# Altium schematic sheet AnalogTransform.SchDoc
size A4; Organization: Technokrat; Address1: 3 Minna Close; Address2: Belrose; Address3: NSW 2085; Address4: Australia; SheetNumber: 4; SheetTotal: 10
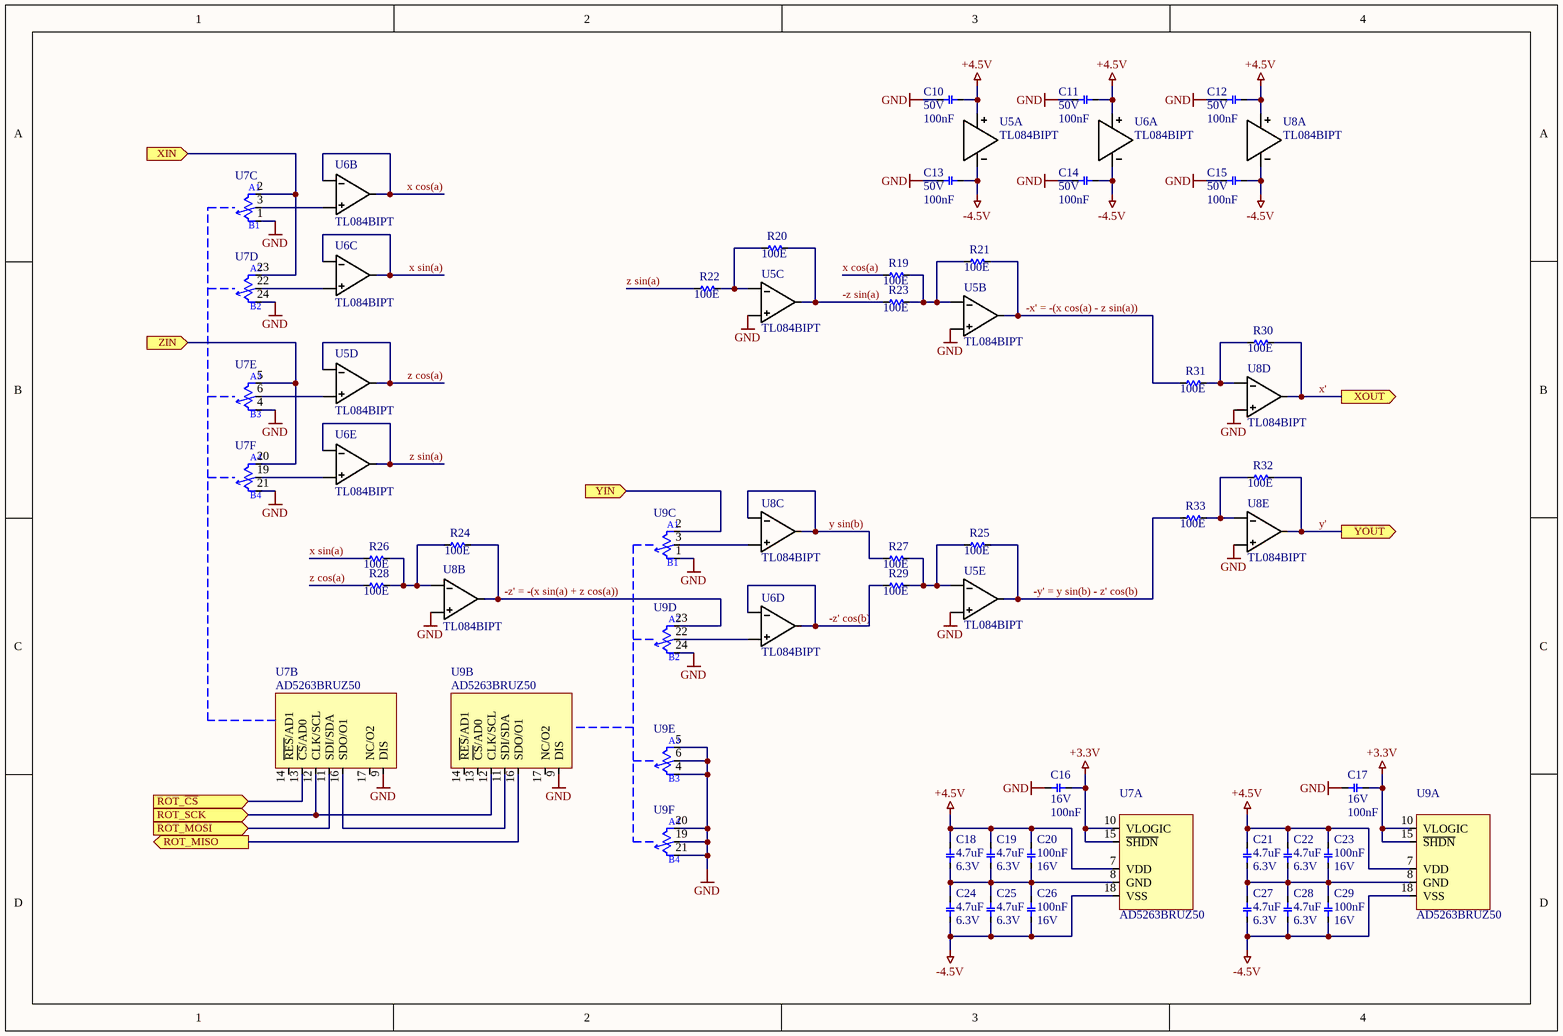
[diagram p0: AnalogTransform.SchDoc]

## Parts
C10  value 100nF  Value2: 50V  [CX7R0402C]  (hidden comment: 04025C104JAT2A)
C11  value 100nF  Value2: 50V  [CX7R0402C]  (hidden comment: 04025C104JAT2A)
C12  value 100nF  Value2: 50V  [CX7R0402C]  (hidden comment: 04025C104JAT2A)
C13  value 100nF  Value2: 50V  [CX7R0402C]  (hidden comment: 04025C104JAT2A)
C14  value 100nF  Value2: 50V  [CX7R0402C]  (hidden comment: 04025C104JAT2A)
C15  value 100nF  Value2: 50V  [CX7R0402C]  (hidden comment: 04025C104JAT2A)
C16  value 100nF  Value2: 16V  [CX7R0402C]  (hidden comment: 0402YC104JAT2A)
C17  value 100nF  Value2: 16V  [CX7R0402C]  (hidden comment: 0402YC104JAT2A)
C18  value 4.7uF  Value2: 6.3V  [CX7R0603K]  (hidden comment: 06036C475JAT2A)
C19  value 4.7uF  Value2: 6.3V  [CX7R0603K]  (hidden comment: 06036C475JAT2A)
C20  value 100nF  Value2: 16V  [CX7R0402C]  (hidden comment: 0402YC104JAT2A)
C21  value 4.7uF  Value2: 6.3V  [CX7R0603K]  (hidden comment: 06036C475JAT2A)
C22  value 4.7uF  Value2: 6.3V  [CX7R0603K]  (hidden comment: 06036C475JAT2A)
C23  value 100nF  Value2: 16V  [CX7R0402C]  (hidden comment: 0402YC104JAT2A)
C24  value 4.7uF  Value2: 6.3V  [CX7R0603K]  (hidden comment: 06036C475JAT2A)
C25  value 4.7uF  Value2: 6.3V  [CX7R0603K]  (hidden comment: 06036C475JAT2A)
C26  value 100nF  Value2: 16V  [CX7R0402C]  (hidden comment: 0402YC104JAT2A)
C27  value 4.7uF  Value2: 6.3V  [CX7R0603K]  (hidden comment: 06036C475JAT2A)
C28  value 4.7uF  Value2: 6.3V  [CX7R0603K]  (hidden comment: 06036C475JAT2A)
C29  value 100nF  Value2: 16V  [CX7R0402C]  (hidden comment: 0402YC104JAT2A)
R19  value 100E  [RC0402]  (hidden comment: 0402FR-07100RL)
R20  value 100E  [RC0402]  (hidden comment: 0402FR-07100RL)
R21  value 100E  [RC0402]  (hidden comment: 0402FR-07100RL)
R22  value 100E  [RC0402]  (hidden comment: 0402FR-07100RL)
R23  value 100E  [RC0402]  (hidden comment: 0402FR-07100RL)
R24  value 100E  [RC0402]  (hidden comment: 0402FR-07100RL)
R25  value 100E  [RC0402]  (hidden comment: 0402FR-07100RL)
R26  value 100E  [RC0402]  (hidden comment: 0402FR-07100RL)
R27  value 100E  [RC0402]  (hidden comment: 0402FR-07100RL)
R28  value 100E  [RC0402]  (hidden comment: 0402FR-07100RL)
R29  value 100E  [RC0402]  (hidden comment: 0402FR-07100RL)
R30  value 100E  [RC0402]  (hidden comment: 0402FR-07100RL)
R31  value 100E  [RC0402]  (hidden comment: 0402FR-07100RL)
R32  value 100E  [RC0402]  (hidden comment: 0402FR-07100RL)
R33  value 100E  [RC0402]  (hidden comment: 0402FR-07100RL)
U5  TL084BIPT  [TSSOP14_0.65_C]  (parts A,B,C,D,E of 5)
U6  TL084BIPT  [TSSOP14_0.65_C]  (parts A,B,C,D,E of 5)
U7  AD5263BRUZ50  [TSSOP24_0.65_C]  (parts A,B,C,D,E,F of 6)
U8  TL084BIPT  [TSSOP14_0.65_C]  (parts A,B,C,D,E of 5)
U9  AD5263BRUZ50  [TSSOP24_0.65_C]  (parts A,B,C,D,E,F of 6)

## Ports
ROT_MISO (out), ROT_MOSI (in), ROT_SCK (in), ROT_~{CS} (in), XIN (in), XOUT (out), YIN (in), YOUT (out), ZIN (in)

## Nets
+3.3V: C16.2 C17.2 U7.10(VLOGIC) U7.15(~{SHDN}) U9.10(VLOGIC) U9.15(~{SHDN})
+4.5V: C10.2 C11.2 C12.2 C18.2 C19.2 C20.2 C21.2 C22.2 C23.2 U5.4(VCC+) U6.4(VCC+) U7.7(VDD) U8.4(VCC+) U9.7(VDD)
-4.5V: C13.2 C14.2 C15.2 C24.1 C25.1 C26.1 C27.1 C28.1 C29.1 U5.11(VCC-) U6.11(VCC-) U7.18(VSS) U8.11(VCC-) U9.18(VSS)
GND: C10.1 C11.1 C12.1 C13.1 C14.1 C15.1 C16.1 C17.1 U5.3(IN1+) U5.5(IN2+) U5.12(IN4+) U7.1(B1) U7.4(B3) U7.9(DIS) U7.21(B4) U7.24(B2) U8.3(IN1+) U8.10(IN3+) U8.12(IN4+) U9.1(B1) U9.4(B3) U9.5(A3) U9.6(W3) U9.9(DIS) U9.19(W4) U9.20(A4) U9.21(B4) U9.24(B2)
-x' = -(x cos(a) - z sin(a)): R21.2 R31.1 U5.1(OUT1)
-y' = y sin(b) - z' cos(b): R25.2 R33.1 U5.14(OUT4)
-z sin(a): R20.2 R23.1 U5.7(OUT2)
-z' = -(x sin(a) + z cos(a)): R24.2 U8.1(OUT1) U9.23(A2)
-z' cos(b): R29.1 U6.8(OUT3) U6.9(IN3-)
ROT_~{CS}: U7.13(~{CS}/AD0) ; port ROT_~{CS}
ROT_MISO: U9.16(SDO/O1) ; port ROT_MISO
ROT_MOSI: U7.11(SDI/SDA) ; port ROT_MOSI
ROT_SCK: U7.12(CLK/SCL) U9.12(CLK/SCL) ; port ROT_SCK
x cos(a): R19.1 U6.1(OUT1) U6.2(IN1-)
x sin(a): R26.1 U6.6(IN2-) U6.7(OUT2)
x': R30.2 U8.8(OUT3) ; port XOUT
XIN: U7.2(A1) U7.23(A2) ; port XIN
y sin(b): R27.1 U8.6(IN2-) U8.7(OUT2)
y': R32.2 U8.14(OUT4) ; port YOUT
YIN: U9.2(A1) ; port YIN
z cos(a): R28.1 U5.8(OUT3) U5.9(IN3-)
z sin(a): R22.1 U6.13(IN4-) U6.14(OUT4)
ZIN: U7.5(A3) U7.20(A4) ; port ZIN
NetC18_1: C18.1 C19.1 C20.1 C24.2 C25.2 C26.2 U7.8(GND)
NetC21_1: C21.1 C22.1 C23.1 C27.2 C28.2 C29.2 U9.8(GND)
NetR19_2: R19.2 R21.1 R23.2 U5.2(IN1-)
NetR20_1: R20.1 R22.2 U5.6(IN2-)
NetR24_1: R24.1 R26.2 R28.2 U8.2(IN1-)
NetR25_1: R25.1 R27.2 R29.2 U5.13(IN4-)
NetR30_1: R30.1 R31.2 U8.9(IN3-)
NetR32_1: R32.1 R33.2 U8.13(IN4-)
NetU5_10: U5.10(IN3+) U7.6(W3)
NetU6_3: U6.3(IN1+) U7.3(W1)
NetU6_5: U6.5(IN2+) U7.22(W2)
NetU6_10: U6.10(IN3+) U9.22(W2)
NetU6_12: U6.12(IN4+) U7.19(W4)
NetU7_16: U7.16(SDO/O1) U9.11(SDI/SDA)
NetU8_5: U8.5(IN2+) U9.3(W1)

Not connected (* = marked no-connect by the designer): U7 14(~{RES}/AD1) 17(NC/O2); U9 13(~{CS}/AD0) 14(~{RES}/AD1) 17(NC/O2)

## Notes on the sheet
- Rev:
- /
- File:

## Library data of the parts
C10-C15 = kyocera-C-X7R-0402: SMD Capacitor; CapacitanceCode: 104; VoltageCode: 5; Dielectric: C; ToleranceCode: J; MaxThicknessCode: E; Size: 0402
C16 C17 C20 C23 C26 C29 = kyocera-C-X7R-0402: SMD Capacitor; CapacitanceCode: 104; VoltageCode: Y; Dielectric: C; ToleranceCode: J; MaxThicknessCode: E; Size: 0402
C18 C19 C21 C22 C24 C25 C27 C28 = kyocera-C-X7R-0603: SMD Capacitor; Dielectric: C; ToleranceCode: J; MaxThicknessCode: K; VoltageCode: 6; CapacitanceCode: 475; Size: 0603
R19-R33 = YAGEO-RC-0402: SMD Resistor; ToleranceCode: F; PackagingTypeCode: R; TapingReelAndPower: 07; DefaultCode: L; ResistanceCode: 100R; Value2: 62.5mW; Size: 0402; TemperatureCoefficientCode: -
U5 U6 U8 = TL084: J-FET Amplifier 4 Circuit - 14-TSSOP; Type: TL084BIPT
U7 U9 = AD5263BRUZ50: Digital Potentiometer 50k Ohm 4 Circuit 256 Taps I²C, SPI Interface 24-TSSOP; Type: AD5263BRUZ50; Supplier 1: Digi-Key; Supplier Part Number 1: 505-AD5263BRUZ50-ND